# EAGLE schematic emitter follower_punto di lavoro (EAGLE 9.6.2)
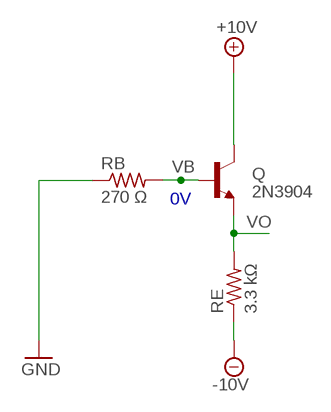
[diagram p0: schematic, sheet 1]

## Parts
Q  2N3904  [TO92]
RB  270 Ω  R-US_0204/5  [0204/5]
RE  3.3 kΩ  R-US_0204/5  [0204/5]

## Nets
+10V: Q.1(C)
-10V: RE.1
GND: RB.1
VB: Q.2(B) RB.2
VO: Q.3(E) RE.2

## Notes on the sheet
- 0V

## Library data of the parts
Q = transistor:2N3904: NPN TRANSISTOR
RB RE = rcl:R-US_: RESISTOR, American symbol; SPICEPREFIX: R